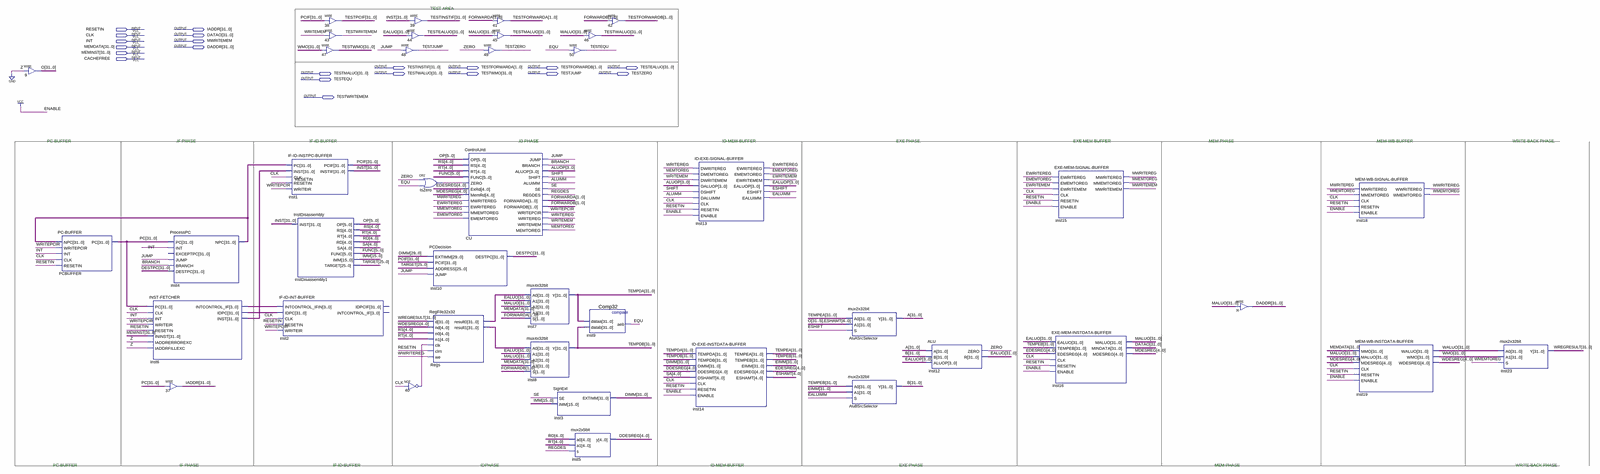
[diagram p0: schematic sheet, whole]
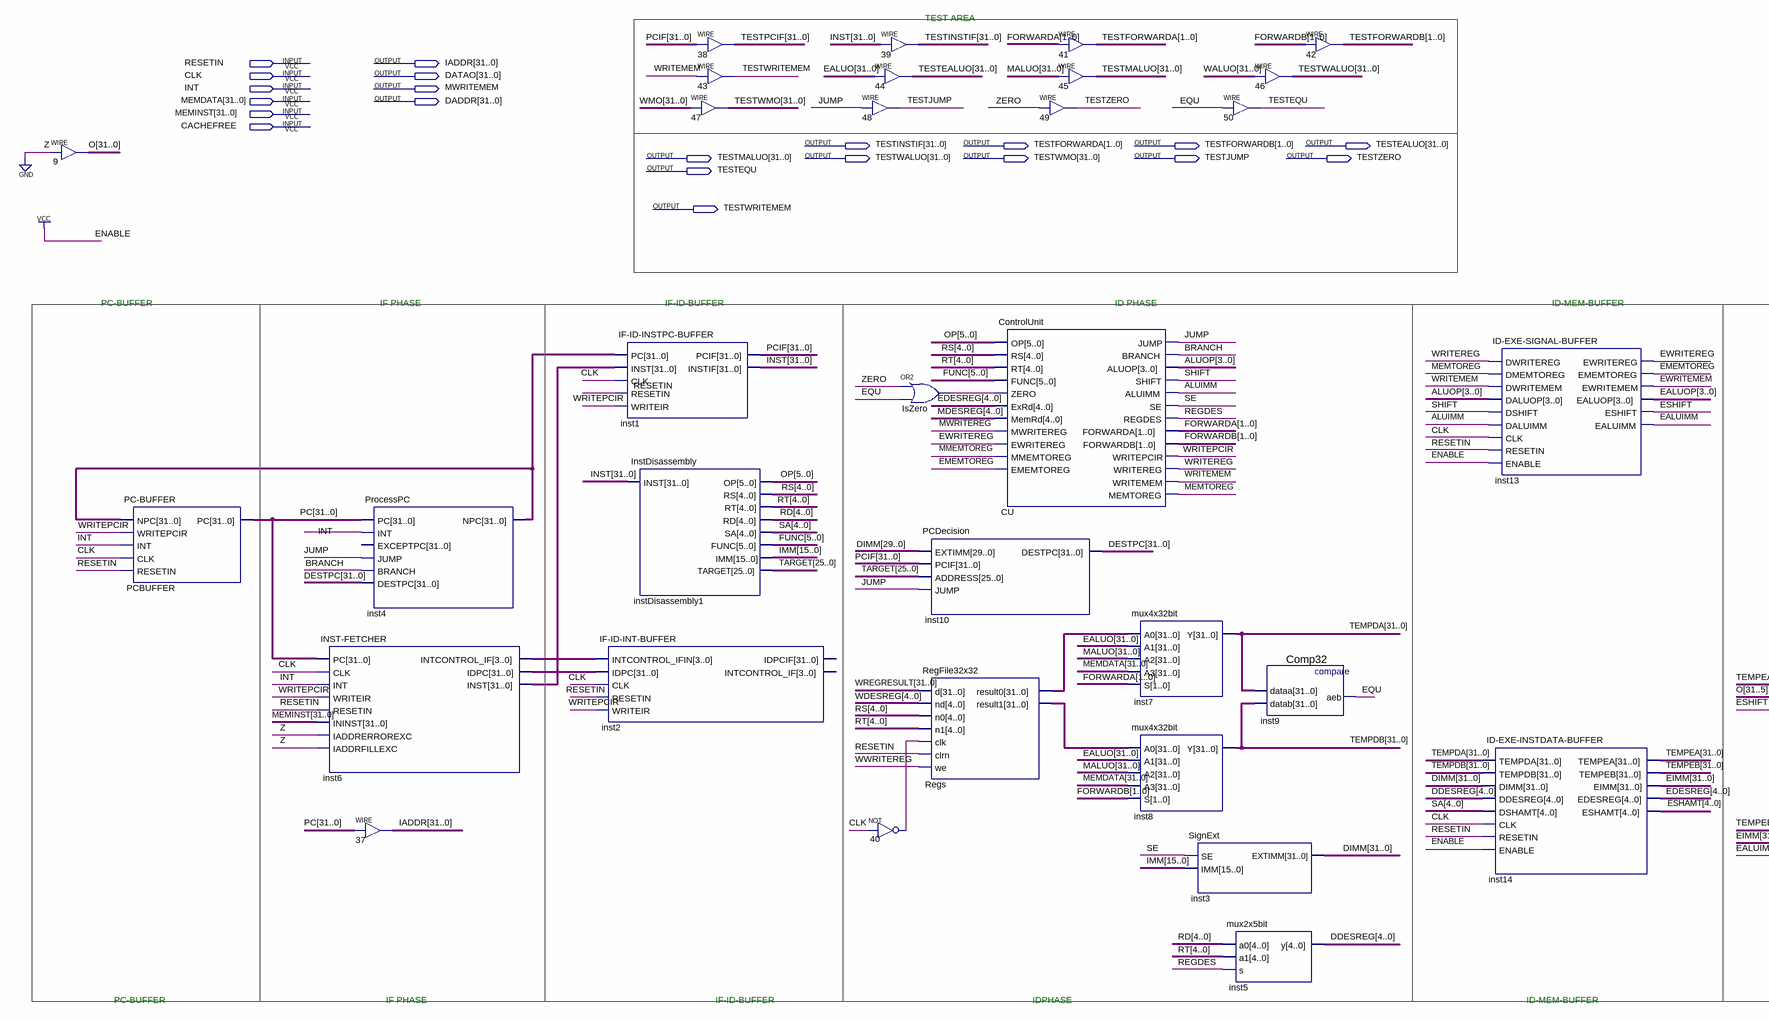
[diagram p1: schematic sheet, left part]
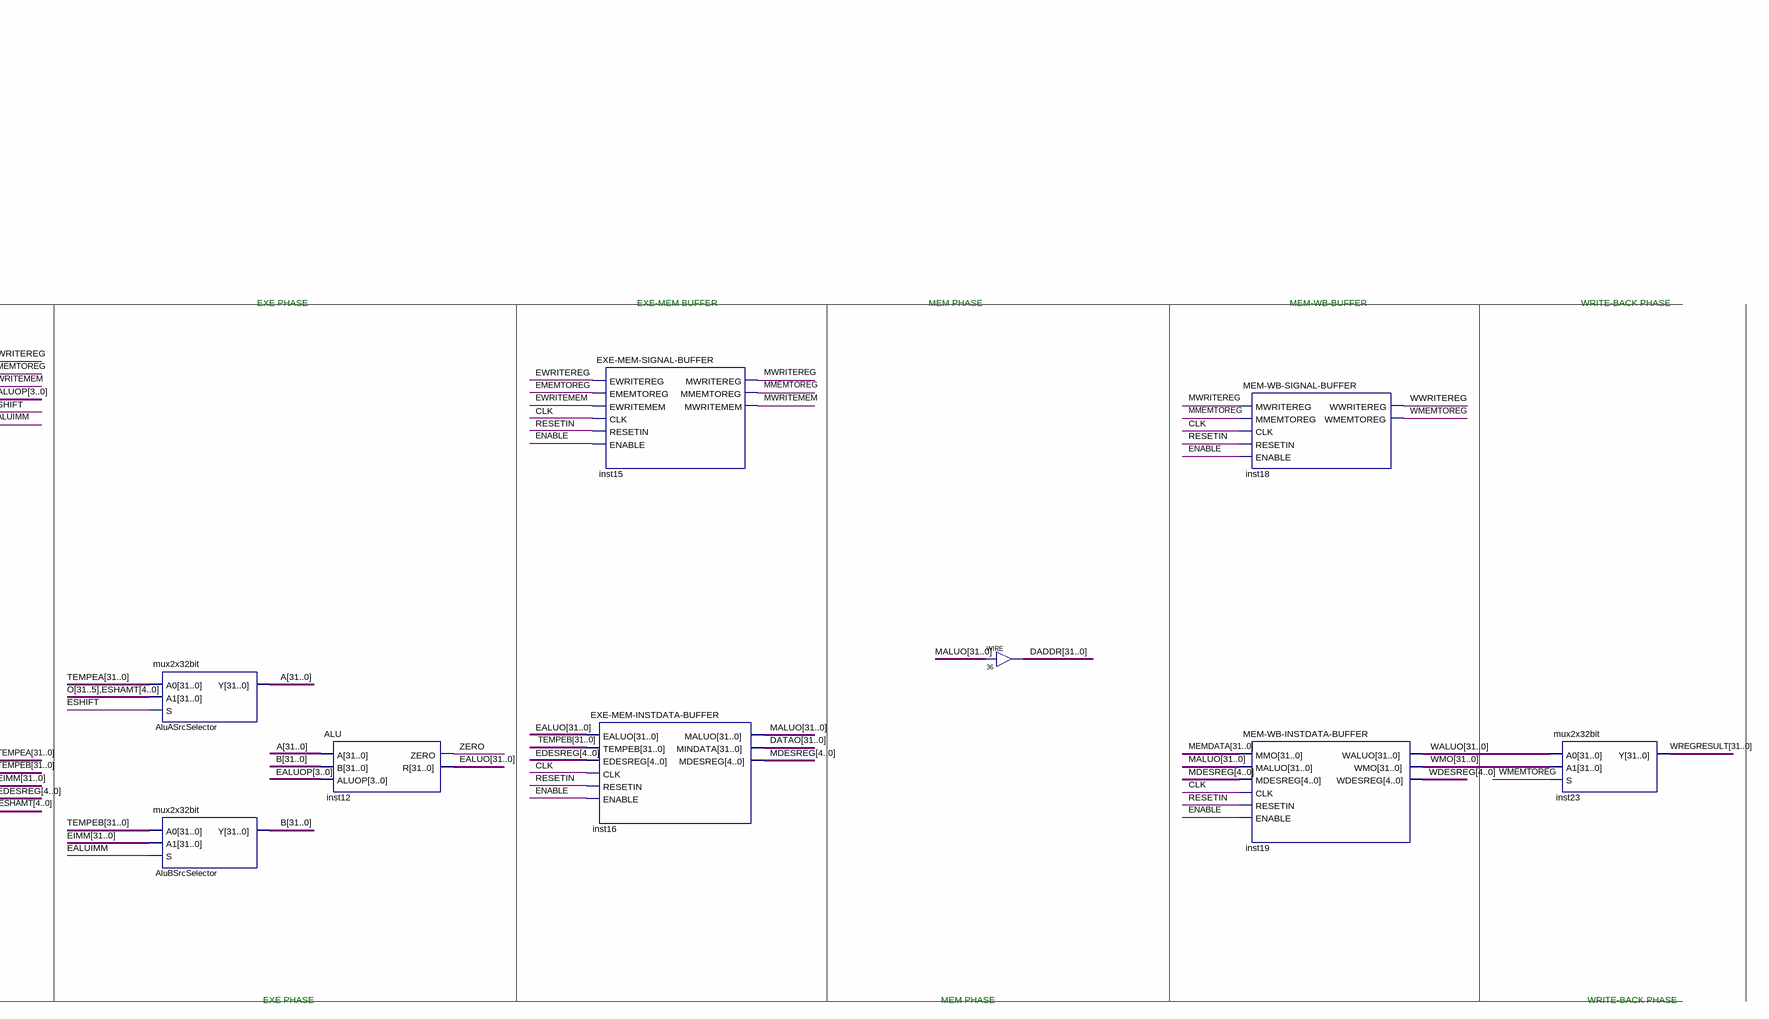
[diagram p2: schematic sheet, right part]
// Quartus schematic PipelineUniProcessor.bdf as structural Verilog: 41 symbols, 21 pins
module PipelineUniProcessor (
  input  RESETIN,
  input  CLK,
  input  INT,
  input  [31:0] MEMDATA,
  input  [31:0] MEMINST,
  input  CACHEFREE,
  output [31:0] IADDR,
  output [31:0] DATAO,
  output MWRITEMEM,
  output [31:0] DADDR,
  output [31:0] TESTINSTIF,
  output [1:0] TESTFORWARDA,
  output [1:0] TESTFORWARDB,
  output [31:0] TESTEALUO,
  output [31:0] TESTMALUO,
  output [31:0] TESTWALUO,
  output [31:0] TESTWMO,
  output TESTJUMP,
  output TESTZERO,
  output TESTEQU,
  output TESTWRITEMEM
);

  wire ALUIMM, BRANCH, EALUIMM, EMEMTOREG, EQU, ESHIFT, EWRITEMEM, EWRITEREG, IsZero_out, JUMP, MEMTOREG,
       MMEMTOREG, MWRITEREG, n40_out, REGDES, SE, SHIFT, WMEMTOREG, WRITEMEM, WRITEPCIR, WRITEREG, WWRITEREG,
       ZERO;
  wire [1:0] FORWARDA, FORWARDB;
  wire [3:0] ALUOP, EALUOP, inst6_intcontrol_if;
  wire [4:0] DDESREG, EDESREG, ESHAMT, MDESREG, RD, RS, RT, SA, WDESREG;
  wire [5:0] FUNC, OP;
  wire [15:0] IMM;
  wire [25:0] TARGET;
  wire [31:0] A, B, DESTPC, DIMM, EALUO, EIMM, INST, inst4_npc, inst6_idpc, inst6_inst, MALUO, O, PC, PCIF,
       Regs_result0, Regs_result1, TEMPDA, TEMPDB, TEMPEA, TEMPEB, TESTPCIF, WALUO, WMO, WREGRESULT;

  assign O = {32{1'b0}};  // WIRE 9
  \PC-BUFFER  PCBUFFER (.NPC(inst4_npc), .WRITEPCIR(WRITEPCIR), .INT(INT), .CLK(CLK), .RESETIN(RESETIN), .PC(PC));
  \INST-FETCHER  inst6 (
    .PC(PC), .CLK(CLK), .INT(INT), .WRITEIR(WRITEPCIR), .RESETIN(RESETIN), .ININST(MEMINST),
    .IADDRERROREXC(1'b0), .IADDRFILLEXC(1'b0), .INTCONTROL_IF(inst6_intcontrol_if), .IDPC(inst6_idpc),
    .INST(inst6_inst));
  ProcessPC inst4 (
    .PC(PC), .INT(INT), .JUMP(JUMP), .BRANCH(BRANCH), .DESTPC(DESTPC), .NPC(inst4_npc));  // open: EXCEPTPC
  assign IADDR = PC;  // WIRE 37
  \IF-ID-INSTPC-BUFFER  inst1 (
    .PC(inst4_npc), .INST(inst6_inst), .CLK(CLK), .RESETIN(RESETIN), .WRITEIR(WRITEPCIR), .PCIF(PCIF),
    .INSTIF(INST));
  InstDisassembly instDisassembly1 (
    .INST(INST), .OP(OP), .RS(RS), .RT(RT), .RD(RD), .SA(SA), .FUNC(FUNC), .IMM(IMM), .TARGET(TARGET));
  \IF-ID-INT-BUFFER  inst2 (
    .INTCONTROL_IFIN(inst6_intcontrol_if), .IDPC(inst6_idpc), .CLK(CLK), .RESETIN(RESETIN),
    .WRITEIR(WRITEPCIR));  // open: IDPCIF, INTCONTROL_IF
  assign TESTPCIF = PCIF;  // WIRE 38
  assign TESTWRITEMEM = WRITEMEM;  // WIRE 43
  assign TESTWMO = WMO;  // WIRE 47
  assign TESTINSTIF = INST;  // WIRE 39
  assign TESTEALUO = EALUO;  // WIRE 44
  assign TESTJUMP = JUMP;  // WIRE 48
  not u_40 (n40_out, CLK);
  or IsZero (IsZero_out, ZERO, EQU);
  PCDecision inst10 (.EXTIMM(DIMM[29:0]), .PCIF(PCIF), .ADDRESS(TARGET), .JUMP(JUMP), .DESTPC(DESTPC));
  RegFile32x32 Regs (
    .d(WREGRESULT), .nd(WDESREG), .n0(RS), .n1(RT), .clk(n40_out), .clrn(RESETIN), .we(WWRITEREG),
    .result0(Regs_result0), .result1(Regs_result1));
  ControlUnit CU (
    .OP(OP), .RS(RS), .RT(RT), .FUNC(FUNC), .ZERO(IsZero_out), .ExRd(EDESREG), .MemRd(MDESREG),
    .MWRITEREG(MWRITEREG), .EWRITEREG(EWRITEREG), .MMEMTOREG(MMEMTOREG), .EMEMTOREG(EMEMTOREG), .JUMP(JUMP),
    .BRANCH(BRANCH), .ALUOP(ALUOP), .SHIFT(SHIFT), .ALUIMM(ALUIMM), .SE(SE), .REGDES(REGDES),
    .FORWARDA(FORWARDA), .FORWARDB(FORWARDB), .WRITEPCIR(WRITEPCIR), .WRITEREG(WRITEREG),
    .WRITEMEM(WRITEMEM), .MEMTOREG(MEMTOREG));
  assign TESTFORWARDA = FORWARDA;  // WIRE 41
  assign TESTMALUO = MALUO;  // WIRE 45
  assign TESTZERO = ZERO;  // WIRE 49
  mux4x32bit inst7 (.A0(Regs_result0), .A1(EALUO), .A2(MALUO), .A3(MEMDATA), .S(FORWARDA), .Y(TEMPDA));
  mux4x32bit inst8 (.A0(Regs_result1), .A1(EALUO), .A2(MALUO), .A3(MEMDATA), .S(FORWARDB), .Y(TEMPDB));
  SignExt inst3 (.SE(SE), .IMM(IMM), .EXTIMM(DIMM));
  assign TESTEQU = EQU;  // WIRE 50
  mux2x5bit inst5 (.a0(RD), .a1(RT), .s(REGDES), .y(DDESREG));
  assign TESTWALUO = WALUO;  // WIRE 46
  Comp32 inst9 (.dataa(TEMPDA), .datab(TEMPDB), .aeb(EQU));
  assign TESTFORWARDB = FORWARDB;  // WIRE 42
  \ID-EXE-SIGNAL-BUFFER  inst13 (
    .DWRITEREG(WRITEREG), .DMEMTOREG(MEMTOREG), .DWRITEMEM(WRITEMEM), .DALUOP(ALUOP), .DSHIFT(SHIFT),
    .DALUIMM(ALUIMM), .CLK(CLK), .RESETIN(RESETIN), .ENABLE(1'b1), .EWRITEREG(EWRITEREG),
    .EMEMTOREG(EMEMTOREG), .EWRITEMEM(EWRITEMEM), .EALUOP(EALUOP), .ESHIFT(ESHIFT), .EALUIMM(EALUIMM));
  \ID-EXE-INSTDATA-BUFFER  inst14 (
    .TEMPDA(TEMPDA), .TEMPDB(TEMPDB), .DIMM(DIMM), .DDESREG(DDESREG), .DSHAMT(SA), .CLK(CLK),
    .RESETIN(RESETIN), .ENABLE(1'b1), .TEMPEA(TEMPEA), .TEMPEB(TEMPEB), .EIMM(EIMM), .EDESREG(EDESREG),
    .ESHAMT(ESHAMT));
  mux2x32bit AluASrcSelector (.A0(TEMPEA), .A1({O[31:5], ESHAMT}), .S(ESHIFT), .Y(A));
  mux2x32bit AluBSrcSelector (.A0(TEMPEB), .A1(EIMM), .S(EALUIMM), .Y(B));
  ALU inst12 (.A(A), .B(B), .ALUOP(EALUOP), .ZERO(ZERO), .R(EALUO));
  \EXE-MEM-SIGNAL-BUFFER  inst15 (
    .EWRITEREG(EWRITEREG), .EMEMTOREG(EMEMTOREG), .EWRITEMEM(EWRITEMEM), .CLK(CLK), .RESETIN(RESETIN),
    .ENABLE(1'b1), .MWRITEREG(MWRITEREG), .MMEMTOREG(MMEMTOREG), .MWRITEMEM(MWRITEMEM));
  \EXE-MEM-INSTDATA-BUFFER  inst16 (
    .EALUO(EALUO), .TEMPEB(TEMPEB), .EDESREG(EDESREG), .CLK(CLK), .RESETIN(RESETIN), .ENABLE(1'b1),
    .MALUO(MALUO), .MINDATA(DATAO), .MDESREG(MDESREG));
  assign DADDR = MALUO;  // WIRE 36
  \MEM-WB-SIGNAL-BUFFER  inst18 (
    .MWRITEREG(MWRITEREG), .MMEMTOREG(MMEMTOREG), .CLK(CLK), .RESETIN(RESETIN), .ENABLE(1'b1),
    .WWRITEREG(WWRITEREG), .WMEMTOREG(WMEMTOREG));
  \MEM-WB-INSTDATA-BUFFER  inst19 (
    .MMO(MEMDATA), .MALUO(MALUO), .MDESREG(MDESREG), .CLK(CLK), .RESETIN(RESETIN), .ENABLE(1'b1),
    .WALUO(WALUO), .WMO(WMO), .WDESREG(WDESREG));
  mux2x32bit inst23 (.A0(WALUO), .A1(WMO), .S(WMEMTOREG), .Y(WREGRESULT));

  // Notes on the sheet:
  //   TEST AREA
  //   PC-BUFFER
  //   IF PHASE
  //   IF-ID-BUFFER
  //   ID PHASE
  //   ID-MEM-BUFFER
  //   EXE PHASE
  //   EXE-MEM BUFFER
  //   MEM PHASE
  //   MEM-WB-BUFFER
  //   WRITE-BACK PHASE
  //   PC-BUFFER
  //   IF PHASE
  //   IF-ID-BUFFER
  //   IDPHASE
  //   ID-MEM-BUFFER
  //   EXE PHASE
  //   MEM PHASE
  //   WRITE-BACK PHASE
endmodule
